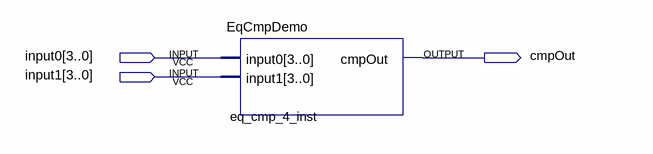
[diagram p0: schematic sheet]
// Quartus schematic EqCmpDemo_2.bdf as structural Verilog: 1 symbols, 3 pins
module EqCmpDemo_2 (
  input  [3:0] input0,
  input  [3:0] input1,
  output cmpOut
);

  EqCmpDemo eq_cmp_4_inst (.input0(input0), .input1(input1), .cmpOut(cmpOut));
endmodule
